# EAGLE design GIP-client (EAGLE 7.1.0)
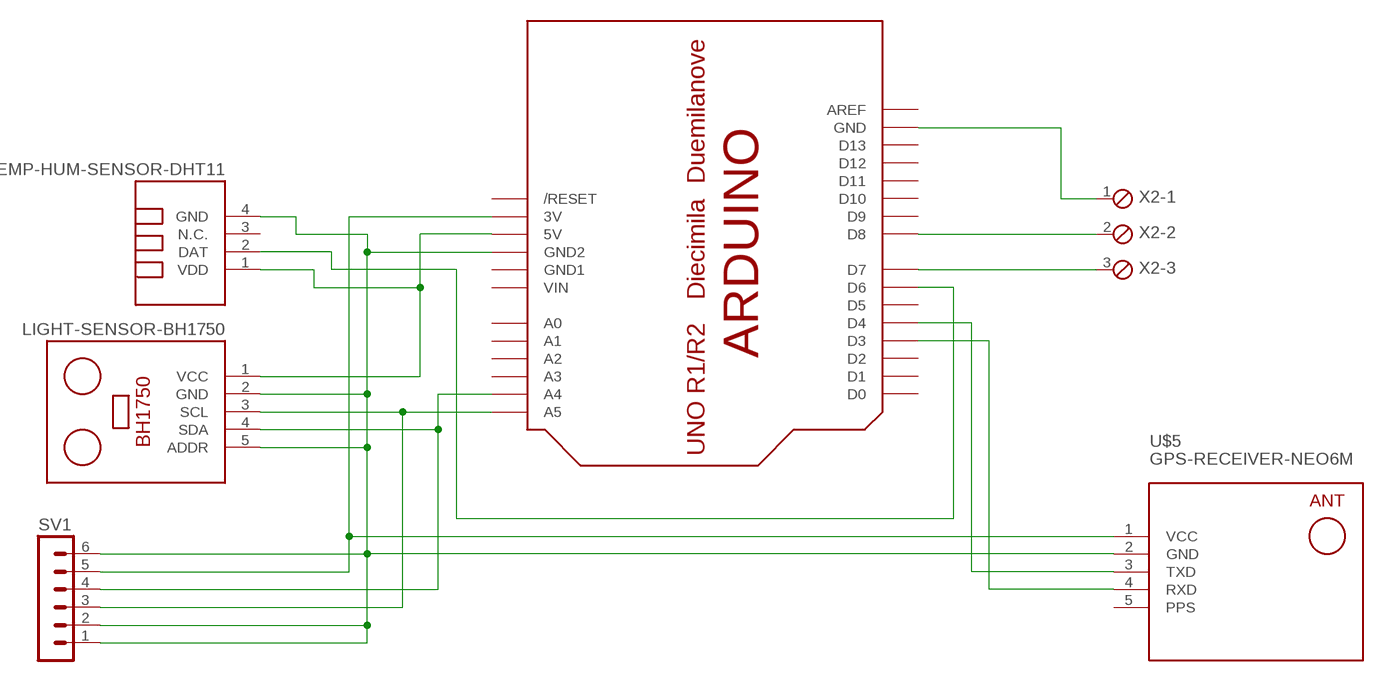
[diagram p0: schematic, sheet 1]

## Parts
SV1  MA06-1  [MA06-1]
U$2  ARDUINO-BPLACE  [ARDUINO-BPLACE]
U$3  TEMP-HUM-SENSOR-DHT11  [TEMP-HUM-SENSOR-DHT11]
U$4  LIGHT-SENSOR-BH1750  [LIGHT-SENSOR-BH1750]
U$5  GPS-RECEIVER-NEO6M  [GPS-RECEIVER-NEO6M]
X2  MPT3  [3POL254]

## Nets
N$1: U$2.GND X2.1
N$2: U$2.D8 X2.2
N$3: U$2.D7 X2.3
N$5: SV1.1 SV1.2 SV1.6 U$2.GND2 U$3.4(GND) U$4.2(GND) U$4.5(ADDR) U$5.2(GND)
N$6: U$2.D6 U$3.2(DAT)
N$7: SV1.4 U$2.A4 U$4.4(SDA)
N$8: SV1.3 U$2.A5 U$4.3(SCL)
N$9: U$2.5V U$3.1(VDD) U$4.1(VCC)
N$14: SV1.5 U$2.3V U$5.1(VCC)
N$15: U$2.D4 U$5.3(TXD)
N$18: U$2.D3 U$5.4(RXD)
Unconnected: U$2.A0 U$2.A1 U$2.A2 U$2.A3 U$2.AREF U$2.D0 U$2.D1 U$2.D2 U$2.D5 U$2.D9 U$2.D10 U$2.D11 U$2.D12 U$2.D13 U$2.RESET(/RESET) U$3.3(N.C.)

## Power pins joined to a net without a drawn wire
GND1: U$2.GND1
PPS: U$5.5(PPS)
VIN: U$2.VIN

## Library data of the parts
SV1 = con-lstb:MA06-1: PIN HEADER; OC_FARNELL: unknown; OC_NEWARK: unknown
U$2 = adafruit:ARDUINO: Arduino Diecimila/Duemilanove Make a shield with ease, this package has all the named pins as well as the two mounting drill holes and an outline of the USB and DC power connector. The outline is on the DIMENSION layer, so if your board house uses it they will cut the outline to match. http://www.ladyada.net/library/pcb/eaglelibrary.html
U$3 = diy-modules:TEMP-HUM-SENSOR-DHT11: DHT11 - digital humidity & temperature sensor DHT11 datasheet available here: https://akizukidenshi.com/download/ds/aosong/DHT11.pdf Click here to find device on ebay.com <http://www.ebay.com/sch/dht11+digital+sensor>
U$4 = diy-modules:LIGHT-SENSOR-BH1750: Digital Light Sensor based on BH1750 BH1750 datasheet is available here: http://www.mouser.com/ds/2/348/bh1750fvi-e-186247.pdf Arduino Library for BH1750 is available here: https://github.com/claws/BH1750 Video Tutorial is available here: https://www.youtube.com/watch?v=UsLcHSbxf_8 Click here to find device on ebay.com <http://www.ebay.com/sch/bh1750fvi+module> Note: There are many variants. Search for the proper version.
U$5 = diy-modules:GPS-RECEIVER-NEO6M: GPS Receiver Module based on NEO-6 device Short tutorial how to use NEO-6 module with Arduino: http://www.xarg.org/2016/06/neo6mv2-gps-module-with-arduino/ NEO-6 datasheet is available here: https://www.u-blox.com/sites/default/files/products/documents/NEO-6_DataSheet_%28GPS.G6-HW-09005%29.pdf Click here to find device on ebay.com <http://www.ebay.com/sch/gyneo6mv2>
X2 = con-phoenix-254:MPT3: PHOENIX CONNECTOR; OC_FARNELL: unknown; OC_NEWARK: unknown

## Board
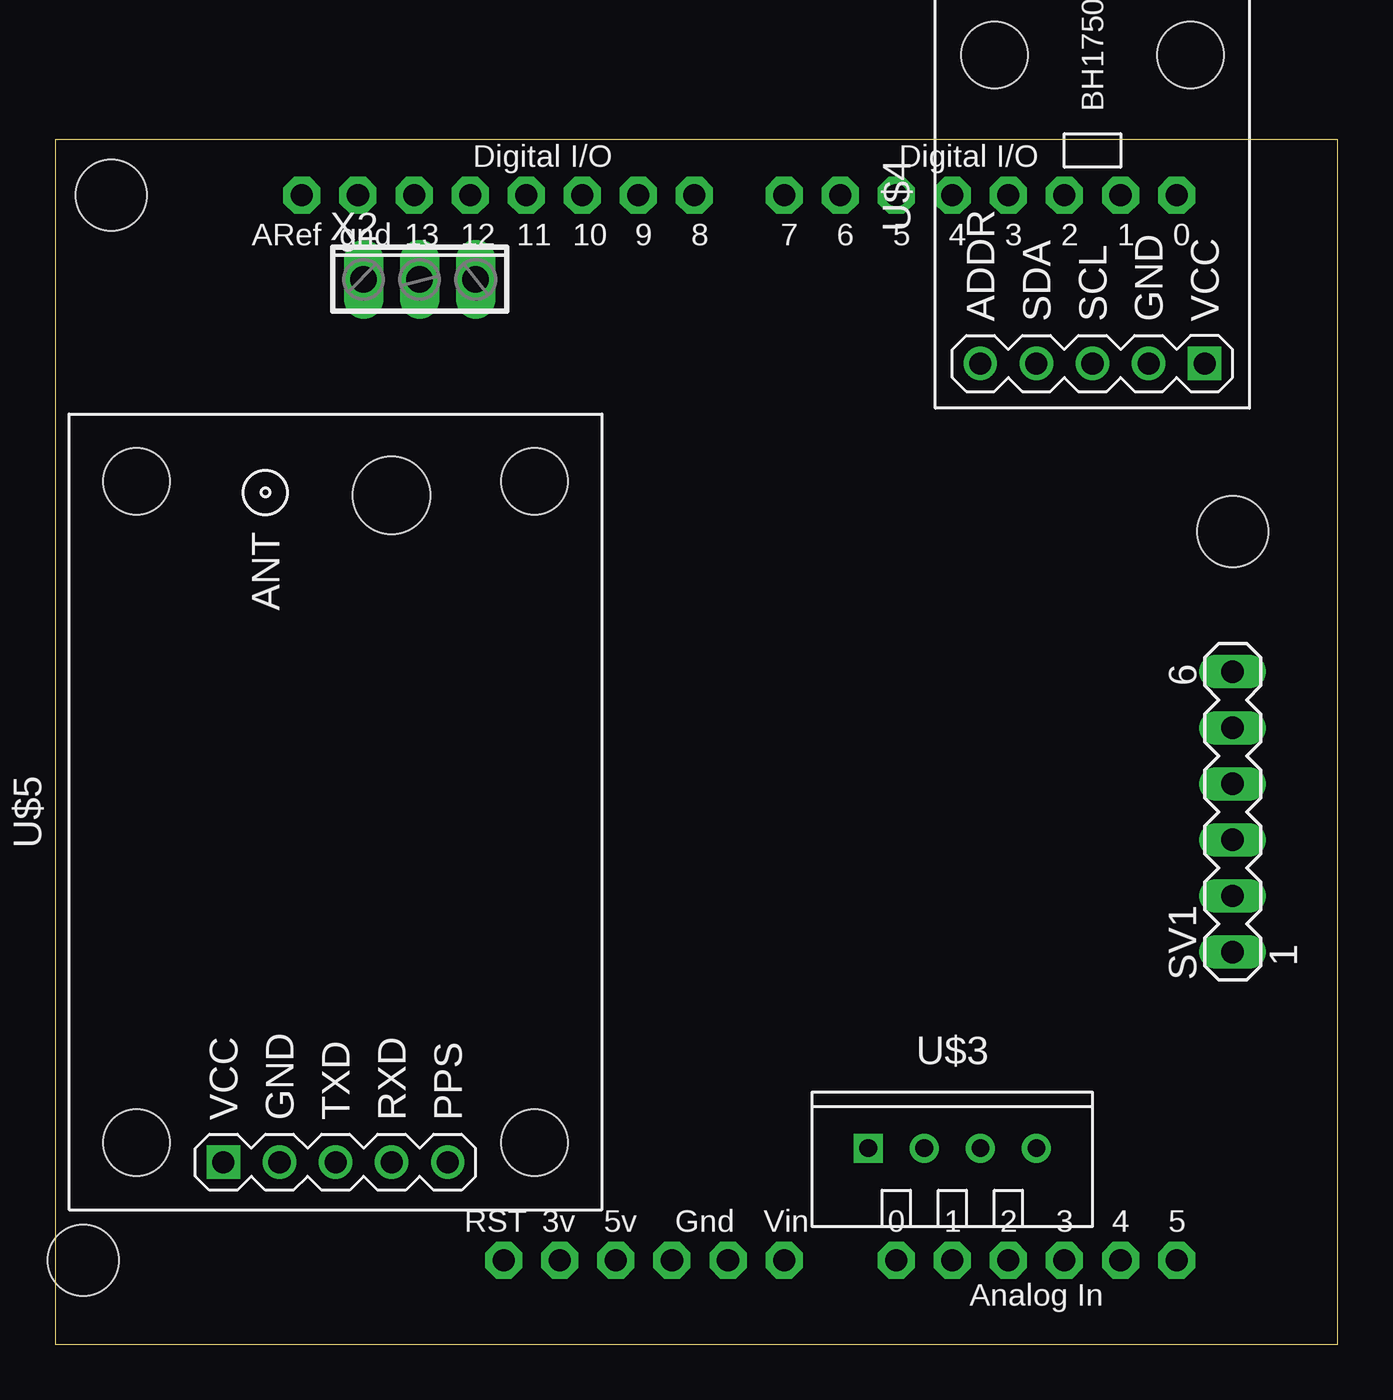
[diagram p1: board, top side]
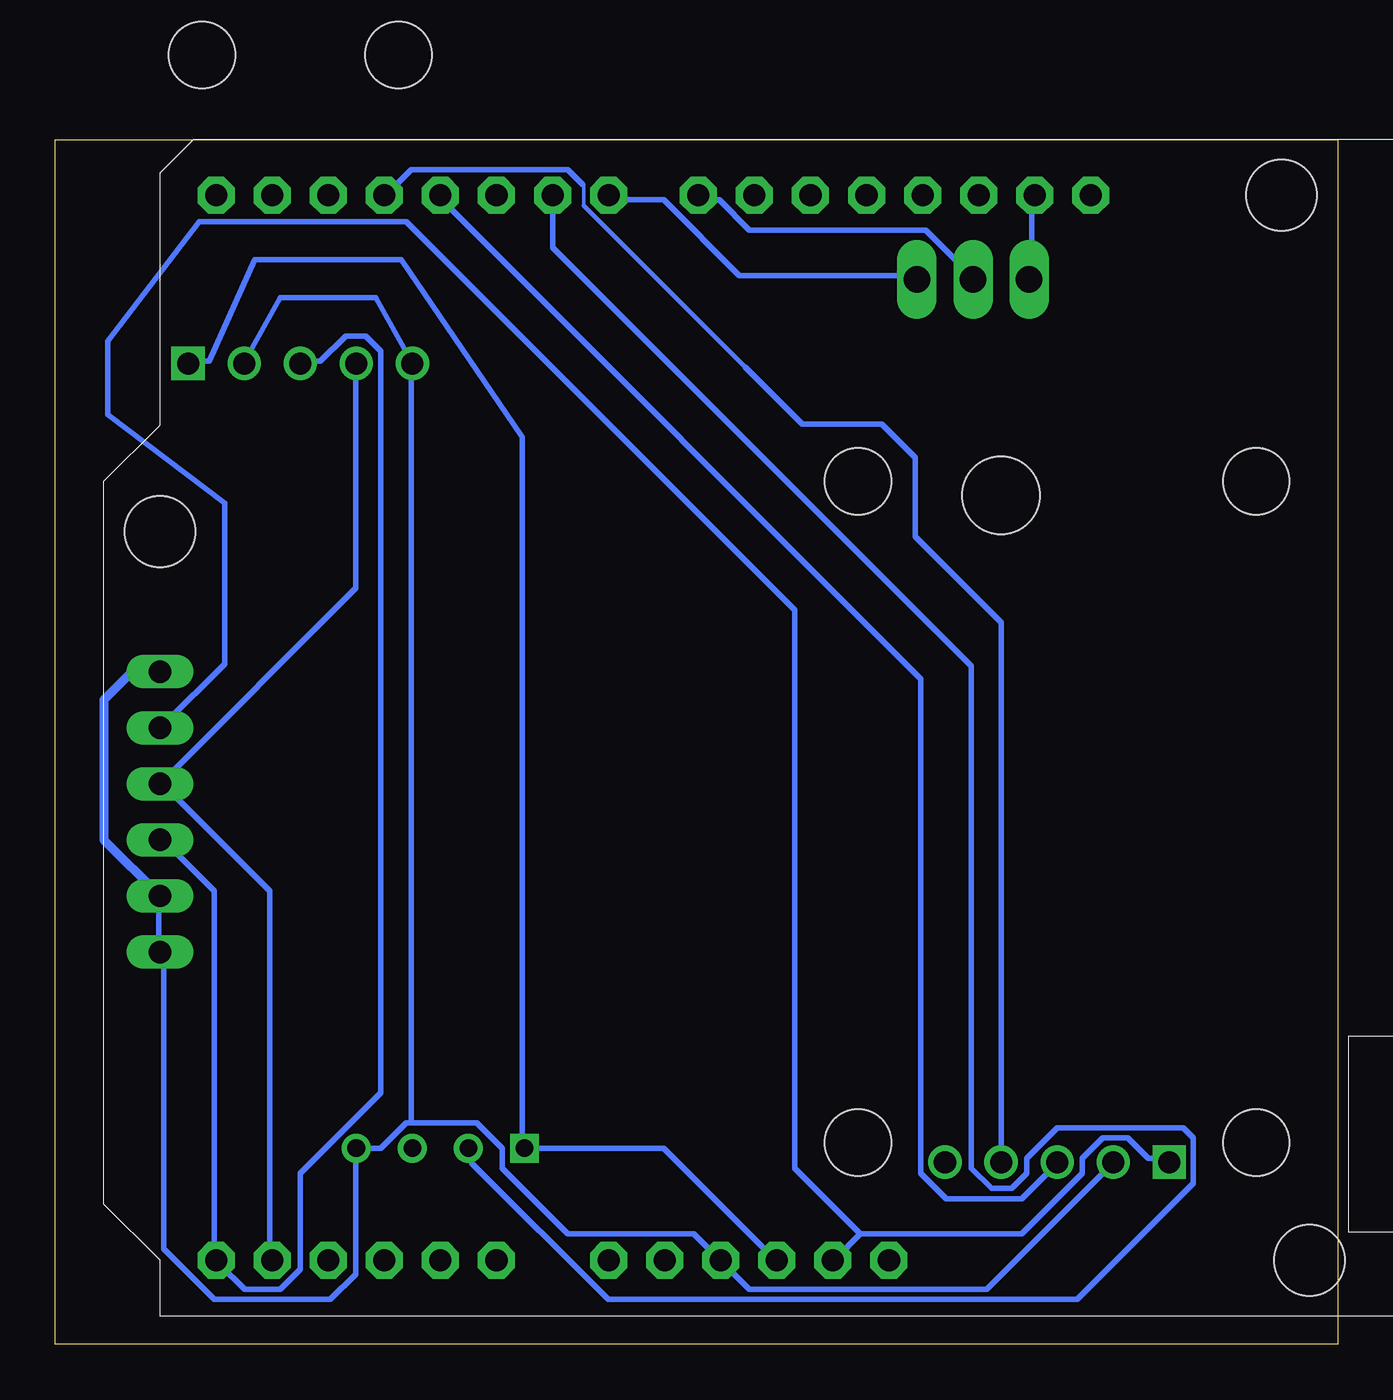
[diagram p2: board, bottom side, seen from below]

Size 58.09 x 54.6 mm. Coordinates in mm from the lower left corner, seen from the top.
Outline: 0,0 58.09,0 58.09,54.6 0,54.6 0,0
Copper layers (1*16): Top 0.035mm / dielectric 1.5mm / Bottom 0.035mm
Design rules "default": minimum track width 10mil, minimum drill 24mil, track to track 8mil, track to pad 8mil, pad to pad 8mil, via to via 8mil, smd to smd 8mil, copper to edge 40mil, drill to drill 8mil, minimum pad ring 10mil, minimum via ring 8mil, stop-mask expansion 4mil, vias tented up to drill 0mil, thermal gap 10mil

### Footprints (pad centres in the part's own frame; a part is rotated, then mirrored left to right if it is on the bottom)
MA06-1 = drill 1.016 long: 1 -6.35,0; 2 -3.81,0; 3 -1.27,0; 4 1.27,0; 5 3.81,0; 6 6.35,0
ARDUINO-BPLACE = drill 1 pad 1.676 octagon: 3V 35.56,2.54; 5V 38.1,2.54; A0 50.8,2.54; A1 53.34,2.54; A2 55.88,2.54; A3 58.42,2.54; A4 60.96,2.54; A5 63.5,2.54; AREF 23.876,50.8; D0 63.5,50.8; D1 60.96,50.8; D2 58.42,50.8; D3 55.88,50.8; D4 53.34,50.8; D5 50.8,50.8; D6 48.26,50.8; D7 45.72,50.8; D8 41.656,50.8; D9 39.116,50.8; D10 36.576,50.8; D11 34.036,50.8; D12 31.496,50.8; D13 28.956,50.8; GND 26.416,50.8; GND1 43.18,2.54; GND2 40.64,2.54; RESET 33.02,2.54; VIN 45.72,2.54 | hole 3.2: 15.24,50.8; 66.04,35.56; 13.97,2.54
TEMP-HUM-SENSOR-DHT11 = drill 0.8 square: 1 -3.81,0 | drill 0.8: 2 -1.27,0; 3 1.27,0; 4 3.81,0
LIGHT-SENSOR-BH1750 = drill 1 square: 1 -7.62,-5.08 | drill 1: 2 -7.62,-2.54; 3 -7.62,0; 4 -7.62,2.54; 5 -7.62,5.08 | hole 3: 6.35,4.445; 6.35,-4.445
GPS-RECEIVER-NEO6M = drill 1 square: 1 -15.875,5.08 | drill 1: 2 -15.875,2.54; 3 -15.875,0; 4 -15.875,-2.54; 5 -15.875,-5.08 | hole 3: -14.986,9.017; -14.986,-9.017; 14.986,-9.017; 14.986,9.017 | hole 3.5: 14.351,-2.54
3POL254 = drill 1.2 long: 1 -2.54,0; 2 0,0; 3 2.54,0

### Placement (x,y rotation side)
SV1  53.34,24.13 90 top
U$2  -12.7,1.27 0 top
U$3  40.64,8.89 0 top
U$4  46.99,52.07 90 top
U$5  12.7,24.13 90 top
X2  16.51,48.26 0 top

### Tracks (layer width: path | path; a pad name or v marks a point on that pad's centre or on a via)
N$1
  Bottom 0.254: U$2.GND 13.84,51.87 13.84,48.44 X2.1
N$2
  Bottom 0.254: U$2.D8 28.93,51.87 28.02,51.87 26.64,50.49 18.64,50.49 16.59,48.44 X2.2
N$3
  Bottom 0.254: U$2.D7 32.82,51.87 30.53,51.87 27.1,48.44 19.1,48.44 X2.3
N$5
  Bottom 0.254: U$4.2 49.5,44.55 47.9,47.42 43.56,47.42 41.96,44.55 U$4.5 41.96,44.32 41.96,10.03 | SV1.2 53.39,20.32 53.39,17.8 SV1.1 53.16,17.58 53.16,4.32 50.88,2.03 45.62,2.03 44.47,3.18 44.47,8.89 U$3.4 43.33,8.89 42.19,10.03 41.96,10.03 | 41.96,10.03 38.99,10.03 37.85,8.89 37.85,7.98 34.87,5 29.16,5 28.02,3.86 U$2.GND2 27.79,3.63 26.64,2.49 15.9,2.49 10.19,8.2 U$5.2
  Bottom 0.406: SV1.6 54.61,30.48 55.88,29.21 55.88,22.86 SV1.2
N$6
  Bottom 0.254: U$2.D6 35.56,49.71 16.59,30.73 16.59,7.98 15.67,7.06 14.76,7.06 14.07,7.75 14.07,8.43 12.7,9.8 6.98,9.8 6.53,9.35 6.53,7.29 11.79,2.03 33.05,2.03 39.22,8.2 39.22,8.89 U$3.2
N$7
  Bottom 0.254: U$4.4 44.47,44.32 44.47,34.27 SV1.4 53.16,25.35 48.36,20.55 48.36,3.86 U$2.A4
N$8
  Bottom 0.254: U$4.3 46.99,44.55 46.08,44.55 44.93,45.7 44.02,45.7 43.33,45.01 43.33,11.41 46.99,7.75 46.99,3.4 47.9,2.49 49.5,2.49 50.65,3.63 U$2.A5 50.88,3.86 50.88,20.55 53.16,22.84 SV1.3
N$9
  Bottom 0.254: U$2.5V 25.5,3.86 30.53,8.89 U$3.1 36.93,8.89 36.93,41.12 42.42,49.15 49.05,49.15 51.11,44.55 52.02,44.55 U$4.1
N$14
  Bottom 0.254: 21.61,5 14.3,5 11.56,7.75 11.56,8.43 10.64,9.35 9.5,9.35 8.59,8.43 7.67,8.43 U$5.1 | 21.61,5 22.76,3.86 U$2.3V | 21.61,5 24.59,7.98 24.59,33.27 42.19,50.88 51.56,50.88 55.7,45.47 55.7,42.14 50.42,38.12 50.42,30.84 53.16,28.09 SV1.5
N$15
  Bottom 0.254: U$5.3 12.7,8.2 14.3,6.6 17.73,6.6 18.87,7.75 18.87,30.15 40.59,51.87 U$2.D4
N$18
  Bottom 0.152: 34.19,52.55 34.14,52.5 34.14,51.61
  Bottom 0.203: 34.14,51.61 26.82,44.29
  Bottom 0.254: 34.19,52.55 34.87,53.24 41.96,53.24 43.1,52.1 U$2.D3 | 15.44,8.43 U$5.4 15.24,32.71 19.12,36.59 19.12,40.19 20.64,41.71 24.24,41.71 26.82,44.29